# Altium schematic sheet 5V_to_3V3_Regulator.SchDoc
size 279 x 215 mm
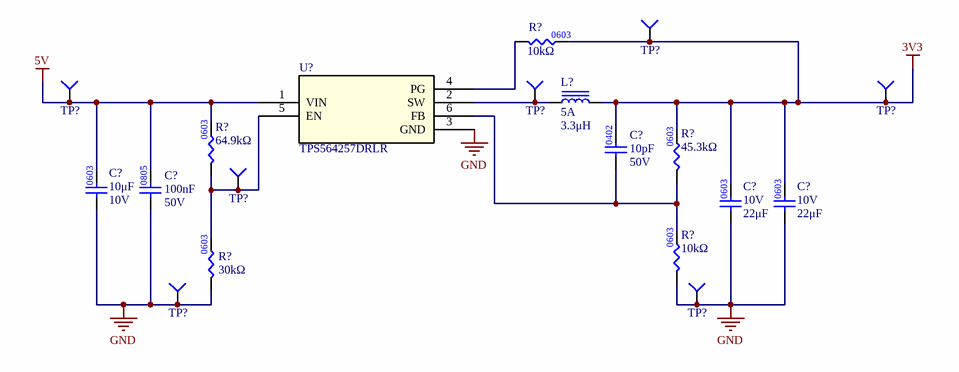
[diagram p0: 5V_to_3V3_Regulator.SchDoc]

## Parts
(Parts that share a designator on the sheet are numbered #1, #2 ... from top to bottom, then left to right.)
C?#1  value 10pF  Voltage Rating: 50V  [CAP0402]  (hidden comment: CAP_10pF_50V_0402)
C?#2  value 10μF  Voltage Rating: 10V  [CAP0603]  (hidden comment: CAP_10uF_10V_0603)
C?#3  value 100nF  Voltage Rating: 50V  [CAP0805]  (hidden comment: CAP_100nF_50V_0805)
C?#4  value 22μF  Voltage Rating: 10V  [CAP0603]  (hidden comment: CAP_22uF_10V_0603)
C?#5  value 22μF  Voltage Rating: 10V  [CAP0603]  (hidden comment: CAP_22uF_10V_0603)
L?  Current Rating: 5A  Inductance: 3.3μH  [IND_SRN6045TA-3R3Y]  (hidden comment: IND_3.3uH_5A)
R?#1  value 10kΩ  [RES0603]  (hidden comment: RES_10kΩ_0603_5%)
R?#2  Resistance: 64.9kΩ  [RES1210]  (hidden comment: RES 64.9K OHM 1% 1/10W 0603)
R?#3  Resistance: 45.3kΩ  [RES1210]  (hidden comment: RES 45.3K OHM 1% 1/10W 0603)
R?#4  value 10kΩ  [RES0603]  (hidden comment: RES_10kΩ_0603_5%)
R?#5  value 30kΩ  [RES0603]  (hidden comment: RES_30kΩ_0603_0.5%)
TP?#1  TESTPOINT_SMD_LOOP  [S1751-46R]  (value not drawn)
TP?#2  TESTPOINT_SMD_LOOP  [S1751-46R]  (value not drawn)
TP?#3  TESTPOINT_SMD_LOOP  [S1751-46R]  (value not drawn)
TP?#4  TESTPOINT_SMD_LOOP  [S1751-46R]  (value not drawn)
TP?#5  TESTPOINT_SMD_LOOP  [S1751-46R]  (value not drawn)
TP?#6  TESTPOINT_SMD_LOOP  [S1751-46R]  (value not drawn)
TP?#7  TESTPOINT_SMD_LOOP  [S1751-46R]  (value not drawn)
U?  TPS564257DRLR  [TPS564242DRLR_TEX]

## Nets
3V3: C?#1.2 C?#4.2 C?#5.2 L?.2 R?#1.2 R?#3.2 TP?#1.1(=value) TP?#4.1(=value)
5V: C?#2.2 C?#3.2 R?#2.2 TP?#2.1(=value) U?.1(VIN)
GND: C?#2.1 C?#3.1 C?#4.1 C?#5.1 R?#4.1 R?#5.1 TP?#6.1(=value) TP?#7.1(=value) U?.3(GND)
NetC?#1_1: C?#1.1 R?#3.1 R?#4.2 U?.6(FB)
NetL?_1: L?.1 TP?#3.1(=value) U?.2(SW)
NetR?#1_1: R?#1.1 U?.4(PG)
NetR?#2_1: R?#2.1 R?#5.2 TP?#5.1(=value) U?.5(EN)

## Notes on the sheet
- University of Waterloo Robotics Team
- 200 University Ave W
- REV
- PROJECT
- Waterloo, Ontario, Canada
- N2L 3G1
- DOCUMENT
- ENGINEER
- REVIEWER
- MODIFIED
- SHEET
- OF
- (in symbol CAP_10uF_10V_0603) 0603

## Library data of the parts
C?#1 = CAP_10pF_50V_0402: CAP CER 10PF 50V C0G/NPO 0402; Manufacturer 1: Yageo; Package: 0402; Supplier 1: Digi-Key; Supplier Part Number 1: 311-1014-1-ND; Manufacturer Part Number 1: CAP CER 10PF 50V C0G/NPO 0402
C?#2 = CAP_10uF_10V_0603: CAP CER 10UF 10V X5R 0603; Manufacturer Part Number 1: CC0603MRX5R6BB106; Manufacturer 1: Yageo; Supplier Part Number 1: 311-1817-1-ND; Supplier 1: Digi-Key; Dielectric: X5R
C?#3 = CAP_100nF_50V_0805: CAP CER 0.1UF 50V X7R 0805; Manufacturer 1: Samsung Electro-Mechanics; Manufacturer Part Number 1: CL21B104KBCNNNC; Package/Footprint: 0805; Supplier 1: Digi-Key; Supplier Part Number 1: 1276-1003-1-ND
C?#4 C?#5 = CAP_22uF_10V_0603: CAP CER 22UF 10V X5R 0603; Manufacturer: Taiyo Yuden; Manufacturer Part Number: LMK107BBJ226MA-T; Supplier 1: Digi-Key; Supplier Part Number 1: 587-4913-1-ND; Package: 0603
L? = IND_3.3uH_5A: INDUCTOR 3.3UH 5A 21 MOHM SMD; Manufacturer 1: Bourns Inc.; Manufacturer Part Number 1: SRN6045TA-3R3Y; DC Resistance (DCR): 21mOhm; Inductance Tolerance: 30%; Saturation Current: 7.8A; Test Frequency: 1MHz; Mounting Type: SMD; Supplier 1: Digi-Key; Supplier Part Number 1: SRN6045TA-3R3YCT-ND
R?#1 R?#4 = RES_10kΩ_0603_5%: RES 10K OHM 5% 1/10W 0603; Manufacturer 1: Yageo; Manufacturer Part Number 1: RC0603JR-0710KL; Supplier Part Number 1: 311-10KGRCT-ND; Supplier 1: Digi-Key; Mounting Type: SMD; Package: 0603
R?#2 = RES 64.9K OHM 1% 1/10W 0603: Manufacturer 1: YAGEO; Manufacturer Part Number 1: RC0603FR-0764K9L; Supplier 1: Digi-Key; Mounting Type: SMD; Tolerance: 1%; Supplier Part Number 1: 311-64.9KHRTR-ND; Package: 0603
R?#3 = RES 45.3K OHM 1% 1/10W 0603: Manufacturer 1: Stackpole Electronics Inc; Manufacturer Part Number 1: RMCF0603FT45K3TR-ND; Supplier 1: Digi-Key; Mounting Type: SMD; Tolerance: 1%; Supplier Part Number 1: RMCF0603FT45K3; Package: 0603
R?#5 = RES_30kΩ_0603_0.5%: RES 30K OHM 0.5% 1/10W 0603; Manufacturer 1: Yageo; Manufacturer Part Number 1: RT0603DRD0730KL; Supplier Part Number 1: 311-30KDCT-ND; Supplier 1: Digi-Key; Package: 0603; Tolerance: 0.5%
TP?#1-TP?#7 = TESTPOINT_SMD_LOOP: TESTPOINT SMD LOOP; Manufacturer 1: Harwin; Supplier 1: Digi-Key; Manufacturer Part Number 1: S1751-46R; Mounting Type: SMD; Package/Footprint: SMD; Supplier Part Number 1: 952-1478-1-ND
U? = TPS564257DRLR: Buck Switching Regulator IC Positive Adjustable 0.6V 1 Output 4A SOT-563, SOT-666; Mfr_Name: Texas Instruments; Type: Power Management; Package / Case: SOT-563, SOT-666; Supplier 1: Mouser; Supplier Part Number 1: 595-TPS564257DRLR